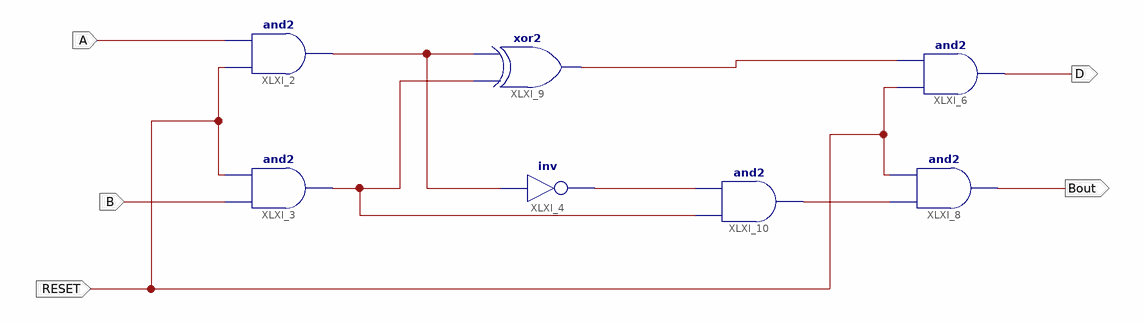
[diagram p0: schematic sheet 1]
// Xilinx ISE schematic HalfSubEnable.sch (artix7) as structural Verilog: 7 symbols, 5 ports
module HalfSubEnable (
  input  A,
  input  B,
  input  RESET,
  output D,
  output Bout
);

  wire XLXN_3, XLXN_4, XLXN_5, XLXN_6, XLXN_7;

  and XLXI_2 (XLXN_7, RESET, A);
  and XLXI_3 (XLXN_4, B, RESET);
  not XLXI_4 (XLXN_3, XLXN_7);
  and XLXI_6 (D, RESET, XLXN_6);
  and XLXI_8 (Bout, XLXN_5, RESET);
  xor XLXI_9 (XLXN_6, XLXN_4, XLXN_7);
  and XLXI_10 (XLXN_5, XLXN_4, XLXN_3);
endmodule
